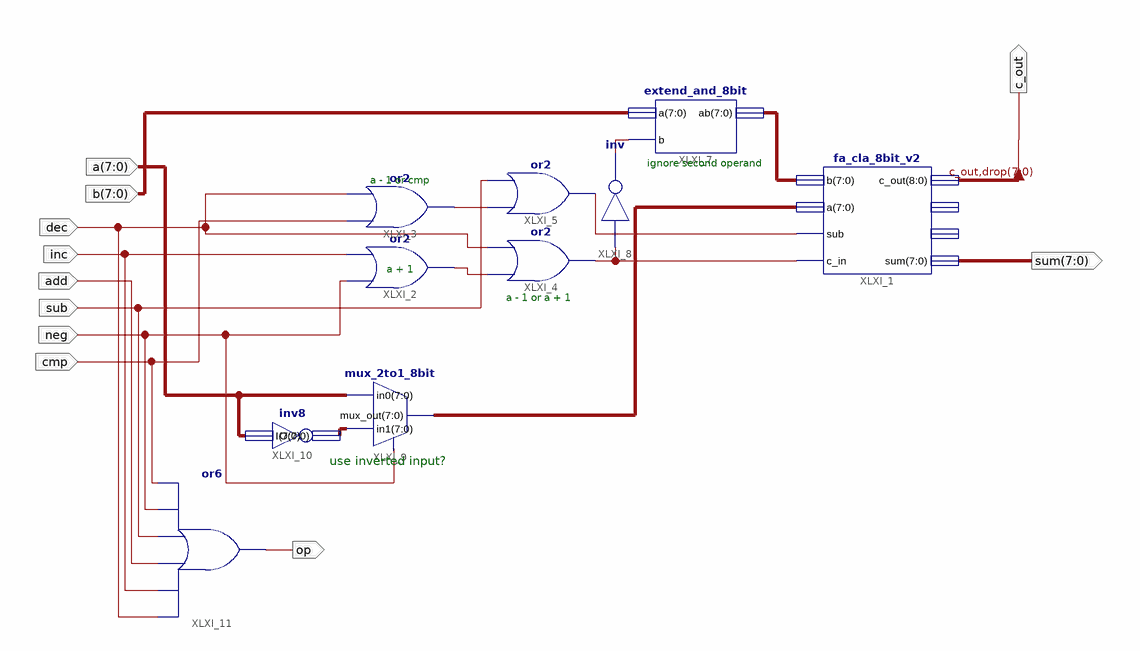
[diagram p0: schematic sheet 1]
// Xilinx ISE schematic alu_arithmetic.sch (spartan3e) as structural Verilog: 10 symbols, 11 ports
module alu_arithmetic (
  input  dec,
  input  inc,
  input  add,
  input  sub,
  input  [7:0] a,
  input  [7:0] b,
  input  neg,
  input  cmp,
  output [7:0] sum,
  output c_out,
  output op
);

  wire XLXN_10, XLXN_11, XLXN_13, XLXN_16, XLXN_17;
  wire [7:0] drop, XLXN_18, XLXN_31, XLXN_36;

  or XLXI_2 (XLXN_10, neg, inc);
  or XLXI_4 (XLXN_17, XLXN_10, dec);
  or XLXI_5 (XLXN_13, XLXN_11, sub);
  fa_cla_8bit_v2 XLXI_1 (
    .b(XLXN_18), .a(XLXN_36), .sub(XLXN_13), .c_in(XLXN_17), .c_out({c_out, drop}), .sum(sum));  // open: p, g
  extend_and_8bit XLXI_7 (.a(b), .b(XLXN_16), .ab(XLXN_18));
  not XLXI_8 (XLXN_16, XLXN_17);
  mux_2to1_8bit XLXI_9 (.in0(a), .sel(neg), .mux_out(XLXN_36), .in1(XLXN_31));
  inv8 XLXI_10 (.I(a), .O(XLXN_31));
  or XLXI_3 (XLXN_11, cmp, dec);
  or XLXI_11 (op, dec, inc, add, sub, neg, cmp);

  // Notes on the sheet:
  //   ignore second operand
  //   a - 1 or cmp
  //   a + 1
  //   a - 1 or a + 1
  //   use inverted input?
endmodule
